# Altium schematic sheet Microcontroller.SchDoc
size A3
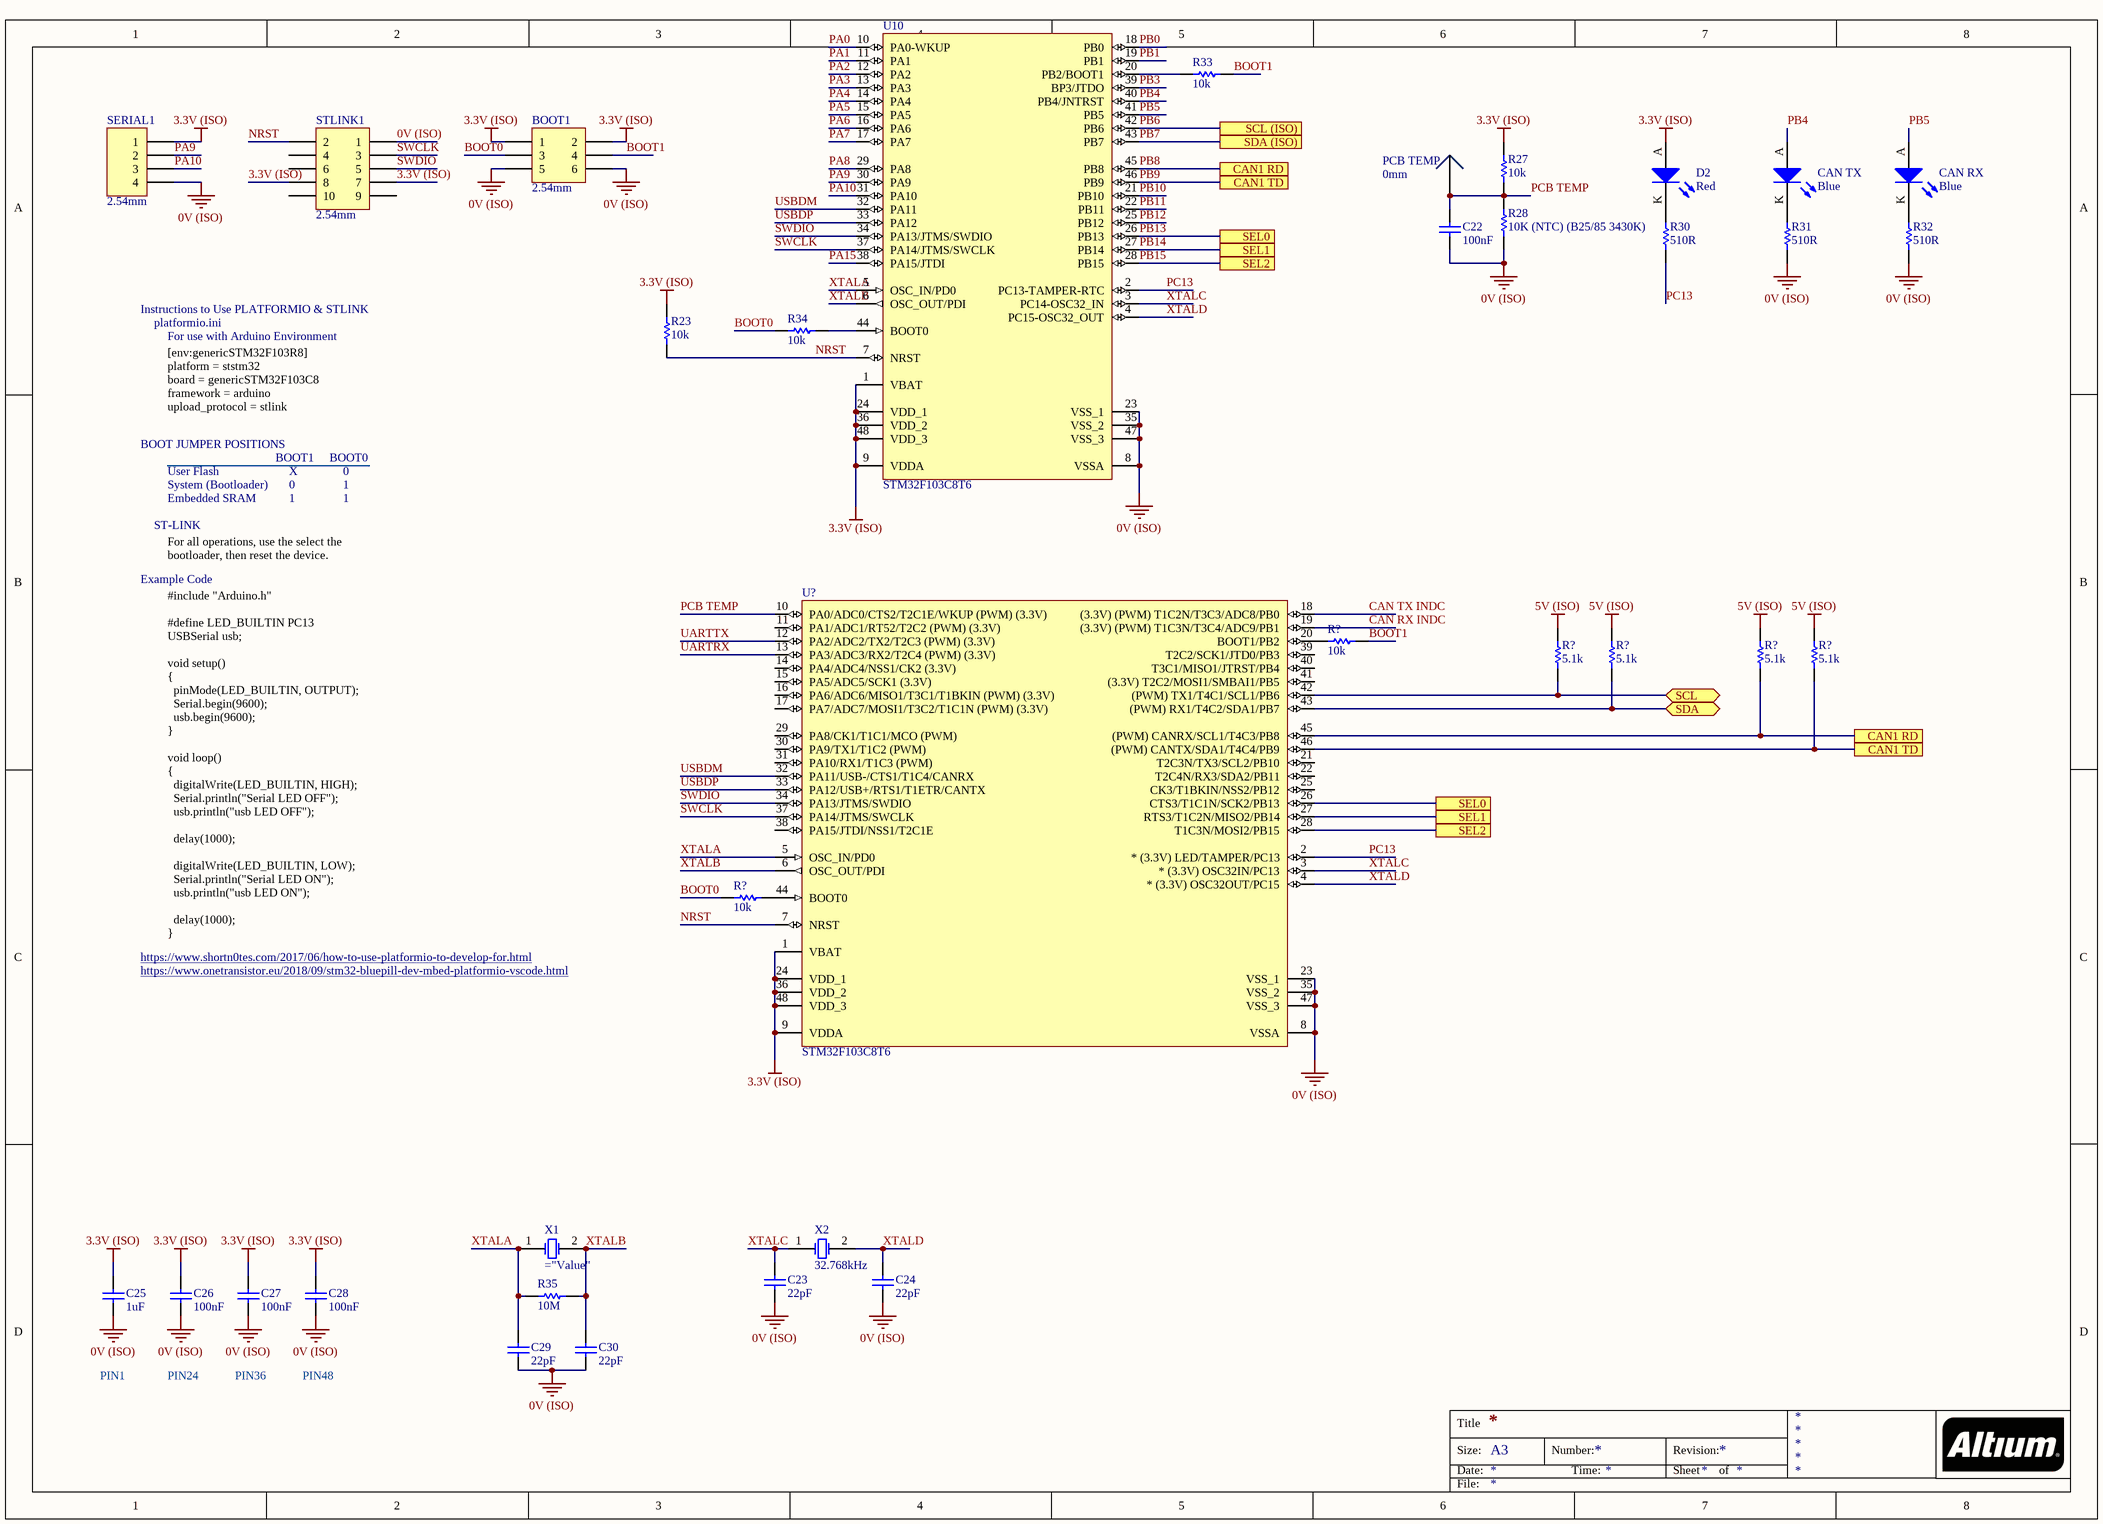
[diagram p0: Microcontroller.SchDoc]

## Parts
(Parts that share a designator on the sheet are numbered #1, #2 ... from top to bottom, then left to right.)
BOOT1  2.54mm  [TH 2.54mm Header 2x3]
C22  100nF  [0805]
C23  22pF  [0805]
C24  22pF  [0805]
C25  1uF  [0805]
C26  100nF  [0805]
C27  100nF  [0805]
C28  100nF  [0805]
C29  22pF  [0805]
C30  22pF  [0805]
CAN_RX  Blue  [0805 LED]
CAN_TX  Blue  [0805 LED]
D2  Red  [0805 LED]
PCB_TEMP  0mm  [SMD Test Point]
R23  10k  [0805]
R27  10k  [0805]
R28  10K (NTC) (B25/85 3430K)  [0805]
R30  510R  [0805]
R31  510R  [0805]
R32  510R  [0805]
R33  10k  [0805]
R34  10k  [0805]
R35  10M  [0805]
R?#1  10k  [0805]
R?#2  5.1k  [0805]
R?#3  5.1k  [0805]
R?#4  5.1k  [0805]
R?#5  5.1k  [0805]
R?#6  10k  [0805]
SERIAL1  2.54mm  [TH 2.54mm Header 1x4]
STLINK1  2.54mm  [TH 2.54mm Header 2x5]
U10  STM32F103C8T6  [STM 48-LQFP]
U?  STM32F103C8T6  [STM 48-LQFP]
X1  (no value)  [Abracon HC-49/US]
X2  32.768kHz  [EPSON 2-SMD]

## Ports
CAN1 RD, CAN1 TD, SCL (bidir), SCL (ISO), SDA (bidir), SDA (ISO), SEL0, SEL1, SEL2

## Nets
0V (ISO): BOOT1.5 BOOT1.6 C22.1 C23.1 C24.1 C25.1 C26.1 C27.1 C28.1 C29.1 C30.1 R28.1 R31.1 R32.1 SERIAL1.4 STLINK1.1 U10.8(VSSA) U10.23(VSS_1) U10.35(VSS_2) U10.47(VSS_3) U?.8(VSSA) U?.23(VSS_1) U?.35(VSS_2) U?.47(VSS_3)
3.3V (ISO): BOOT1.1 BOOT1.2 C25.2 C26.2 C27.2 C28.2 D2.A R23.2 R27.2 SERIAL1.1 STLINK1.7 STLINK1.8 U10.1(VBAT) U10.9(VDDA) U10.24(VDD_1) U10.36(VDD_2) U10.48(VDD_3) U?.1(VBAT) U?.9(VDDA) U?.24(VDD_1) U?.36(VDD_2) U?.48(VDD_3)
5V (ISO): R?#2.2 R?#3.2 R?#4.2 R?#5.2
BOOT0: BOOT1.3 R34.1 R?#6.1
BOOT1: BOOT1.4 R33.2 R?#1.2
CAN RX INDC: U?.19((3.3V)_(PWM)_T1C3N/T3C4/ADC9/PB1)
CAN TX INDC: U?.18((3.3V)_(PWM)_T1C2N/T3C3/ADC8/PB0)
NRST: R23.1 STLINK1.2 U10.7(NRST) U?.7(NRST)
PA0: U10.10(PA0-WKUP)
PA1: U10.11(PA1)
PA2: U10.12(PA2)
PA3: U10.13(PA3)
PA4: U10.14(PA4)
PA5: U10.15(PA5)
PA6: U10.16(PA6)
PA7: U10.17(PA7)
PA8: U10.29(PA8)
PA9: SERIAL1.2 U10.30(PA9)
PA10: SERIAL1.3 U10.31(PA10)
PA15: U10.38(PA15/JTDI)
PB0: U10.18(PB0)
PB1: U10.19(PB1)
PB3: U10.39(BP3/JTDO)
PB4: CAN_TX.A U10.40(PB4/JNTRST)
PB5: CAN_RX.A U10.41(PB5)
PB6: U10.42(PB6) ; port SCL (ISO)
PB7: U10.43(PB7) ; port SDA (ISO)
PB8: R?#4.1 U10.45(PB8) U?.45((PWM)_CANRX/SCL1/T4C3/PB8) ; port CAN1 RD
PB9: R?#5.1 U10.46(PB9) U?.46((PWM)_CANTX/SDA1/T4C4/PB9) ; port CAN1 TD
PB10: U10.21(PB10)
PB11: U10.22(PB11)
PB12: U10.25(PB12)
PB13: U10.26(PB13) U?.26(CTS3/T1C1N/SCK2/PB13) ; port SEL0
PB14: U10.27(PB14) U?.27(RTS3/T1C2N/MISO2/PB14) ; port SEL1
PB15: U10.28(PB15) U?.28(T1C3N/MOSI2/PB15) ; port SEL2
PC13: R30.1 U10.2(PC13-TAMPER-RTC) U?.2(*_(3.3V)_LED/TAMPER/PC13)
PCB TEMP: C22.2 PCB_TEMP.1 R27.1 R28.2 U?.10(PA0/ADC0/CTS2/T2C1E/WKUP_(PWM)_(3.3V))
SCL: R?#2.1 U?.42((PWM)_TX1/T4C1/SCL1/PB6) ; port SCL
SDA: R?#3.1 U?.43((PWM)_RX1/T4C2/SDA1/PB7) ; port SDA
SWCLK: STLINK1.3 U10.37(PA14/JTMS/SWCLK) U?.37(PA14/JTMS/SWCLK)
SWDIO: STLINK1.5 U10.34(PA13/JTMS/SWDIO) U?.34(PA13/JTMS/SWDIO)
UARTRX: U?.13(PA3/ADC3/RX2/T2C4_(PWM)_(3.3V))
UARTTX: U?.12(PA2/ADC2/TX2/T2C3_(PWM)_(3.3V))
USBDM: U10.32(PA11) U?.32(PA11/USB-/CTS1/T1C4/CANRX)
USBDP: U10.33(PA12) U?.33(PA12/USB+/RTS1/T1ETR/CANTX)
XTALA: C29.2 R35.1 U10.5(OSC_IN/PD0) U?.5(OSC_IN/PD0) X1.1(OSC1)
XTALB: C30.2 R35.2 U10.6(OSC_OUT/PDI) U?.6(OSC_OUT/PDI) X1.2(OSC2)
XTALC: C23.2 U10.3(PC14-OSC32_IN) U?.3(*_(3.3V)_OSC32IN/PC13) X2.1(OSC1)
XTALD: C24.2 U10.4(PC15-OSC32_OUT) U?.4(*_(3.3V)_OSC32OUT/PC15) X2.2(OSC2)
NetCAN_RX_K: CAN_RX.K R32.2
NetCAN_TX_K: CAN_TX.K R31.2
NetD2_K: D2.K R30.2
NetR33_1: R33.1 U10.20(PB2/BOOT1)
NetR34_2: R34.2 U10.44(BOOT0)
NetR?#1_1: R?#1.1 U?.20(BOOT1/PB2)
NetR?#6_2: R?#6.2 U?.44(BOOT0)

Not connected (* = marked no-connect by the designer): STLINK1 4 6 9 10; U? 11(PA1/ADC1/RT52/T2C2_(PWM)_(3.3V)) 14(PA4/ADC4/NSS1/CK2_(3.3V)) 15(PA5/ADC5/SCK1_(3.3V)) 16(PA6/ADC6/MISO1/T3C1/T1BKIN_(PWM)_(3.3V)) 17(PA7/ADC7/MOSI1/T3C2/T1C1N_(PWM)_(3.3V)) 21(T2C3N/TX3/SCL2/PB10) 22(T2C4N/RX3/SDA2/PB11) 25(CK3/T1BKIN/NSS2/PB12) 29(PA8/CK1/T1C1/MCO_(PWM)) 30(PA9/TX1/T1C2_(PWM)) 31(PA10/RX1/T1C3_(PWM)) 38(PA15/JTDI/NSS1/T2C1E) 39(T2C2/SCK1/JTD0/PB3) 40(T3C1/MISO1/JTRST/PB4) 41((3.3V)_T2C2/MOSI1/SMBAI1/PB5)

## Notes on the sheet
- Instructions to Use PLATFORMIO & STLINK
- platformio.ini
- For use with Arduino Environment
- BOOT JUMPER POSITIONS
- [env:genericSTM32F103R8]
  platform = ststm32
  board = genericSTM32F103C8
  framework = arduino
  upload_protocol = stlink
- BOOT1
- BOOT0
- ST-LINK
- User Flash
- System (Bootloader)
- Embedded SRAM
- X
- 1
- 0
- Example Code
- For all operations, use the select the bootloader, then reset the device.
- #include "Arduino.h"
  #define LED_BUILTIN PC13
  USBSerial usb;
  void setup()
  {
  pinMode(LED_BUILTIN, OUTPUT);
  Serial.begin(9600);
  usb.begin(9600);
  }
  void loop()
  {
  digitalWrite(LED_BUILTIN, HIGH);
  Serial.println("Serial LED OFF");
  usb.println("usb LED OFF");
  delay(1000);
  digitalWrite(LED_BUILTIN, LOW);
  Serial.println("Serial LED ON");
  usb.println("usb LED ON");
  delay(1000);
  }
- https://www.shortn0tes.com/2017/06/how-to-use-platformio-to-develop-for.html
- https://www.onetransistor.eu/2018/09/stm32-bluepill-dev-mbed-platformio-vscode.html
- PIN1
- PIN24
- PIN36
- PIN48
- Title
- Size:
- Date:
- A3
- Number:
- Time:
- Revision:
- Sheet
- of
- File:

## Library data of the parts
BOOT1 = TH 2.54mm Header 2x3: Positions: 6; Angle: 0; Flange: No; Contact: NA; Part Number: TH 2.54mm Header 2x3; Pitch: 2.54mm; Row Spacing: 2.54mm
C22 C26-C28 = GCM21BR71E104KA37L: Manufacturer: muRata; Tolerance: 10%; Material: X7R; Rated Voltage: 25V; Part Number: GCM21BR71E104KA37L; Value: 100nF
C23 C24 C29 C30 = GCM21B5C1H220JA37L: Manufacturer: muRata; Tolerance: 5%; Material: C0G; Rated Voltage: 50V; Part Number: GCM21B5C1H220JA37L; Value: 22pF
C25 = GCM21BR71A105KA37L: Manufacturer: muRata; Tolerance: 10%; Material: X7R; Rated Voltage: 10V; Part Number: GCM21BR71A105KA37L; Value: 1uF
CAN_RX CAN_TX = SML-MN2BCTT86C: LED BLUE CLEAR 2012 SMD; Manufacturer: ROHM Semiconductor; Part Number: SML-MN2BCTT86C; Colour: Blue; Digikey Part Number: 846-1207-1-ND; Digikey Link: https://www.digikey.com/product-detail/en/rohm-semiconductor/SMLMN2BCTT86C/846-1207-1-ND/6057239
D2 = SML-210LTT86: Red LED Indication - Discrete 1.75V 0805 (2012 Metric); Manufacturer: ROHM Semiconductor; Part Number: SML-210LTT86; Colour: Red; Digikey Part Number: 511-1286-1-ND; Digikey Link: https://www.digikey.com/product-detail/en/rohm-semiconductor/SML-210LTT86/511-1286-1-ND/637099
PCB_TEMP = SMD Test Point: Positions: 1; Row Spacing: 0; Flange: No; Contact: NA; Part Number: SMD Test Point; Pitch: 0mm; Angle: 0
R23 R27 R33 R34 R?#1 R?#6 = RC0805FR0710KL: Manufacturer: YAGEO; Tolerance: 0.01; Rated Voltage: 0.125W; Part Number: RC0805FR0710KL; Value: 10k; Material: FR-07
R28 = NTCS0805E3103FLT: Manufacturer: Vishay Beyschlag; Tolerance: 0.01; Rated Voltage: 210mW; Part Number: NTCS0805E3103FLT; Value: 10K (NTC) (B25/85 3430K); Digikey Part Number: BC2733CT-ND
R30-R32 = RC0805FR07510RL: Manufacturer: YAGEO; Tolerance: 0.01; Rated Voltage: 0.125W; Part Number: RC0805FR07510RL; Value: 510R; Material: FR-07
R35 = RC0805FR0710ML: Manufacturer: YAGEO; Tolerance: 0.01; Rated Voltage: 0.125W; Part Number: RC0805FR0710ML; Value: 10M; Material: FR-07
R?#2-R?#5 = RC0805FR075K1L: Manufacturer: YAGEO; Tolerance: 0.01; Rated Voltage: 0.125W; Part Number: RC0805FR075K1L; Value: 5.1k; Material: FR-07
SERIAL1 = TH 2.54mm Header 1x4: Positions: 4; Angle: 0; Flange: No; Contact: NA; Part Number: TH 2.54mm Header 1x4; Pitch: 2.54mm; Row Spacing: 2.54mm
STLINK1 = TH 2.54mm Header 2x5: Positions: 10; Angle: 0; Flange: No; Contact: NA; Part Number: TH 2.54mm Header 2x5; Pitch: 2.54mm; Row Spacing: 2.54mm
U10 U? = STM32F103C8T6: ARM® Cortex®-M3 STM32F1 Microcontroller IC 32-Bit 72MHz 64KB (64K x 8) FLASH; Manufacturer: STMicroelectronics; Part Number: STM32F103C8T6; Digikey Part Number: 497-6063-ND; Digikey Link: https://www.digikey.com/product-detail/en/stmicroelectronics/STM32F103C8T6/497-6063-ND/1646338
X1 = ABLS-16.000MHZ-B4-T: Manufacturer: Abracon LLC; Load Capacitance: 18pF; ESR: 40R; Part Number: ABLS-16.000MHZ-B4-T; Digikey Part Number: 535-10226-1-ND; Digikey Link: https://www.digikey.com/product-detail/en/abracon-llc/ABLS-16.000MHZ-B4-T/535-10226-1-ND/2184261
X2 = FC-135 32.7680KA-A5: Manufacturer: EPSON; Load Capacitance: 12.5pF; ESR: 70k; Part Number: FC-135 32.7680KA-A5; Value: 32.768kHz; Digikey Part Number: SER4103TR-ND; Digikey Link: https://www.digikey.com/product-detail/en/epson/FC-135-32.7680KA-A5/SER4103TR-ND/5259895